# EAGLE schematic #1_routed (EAGLE 9.6.2)
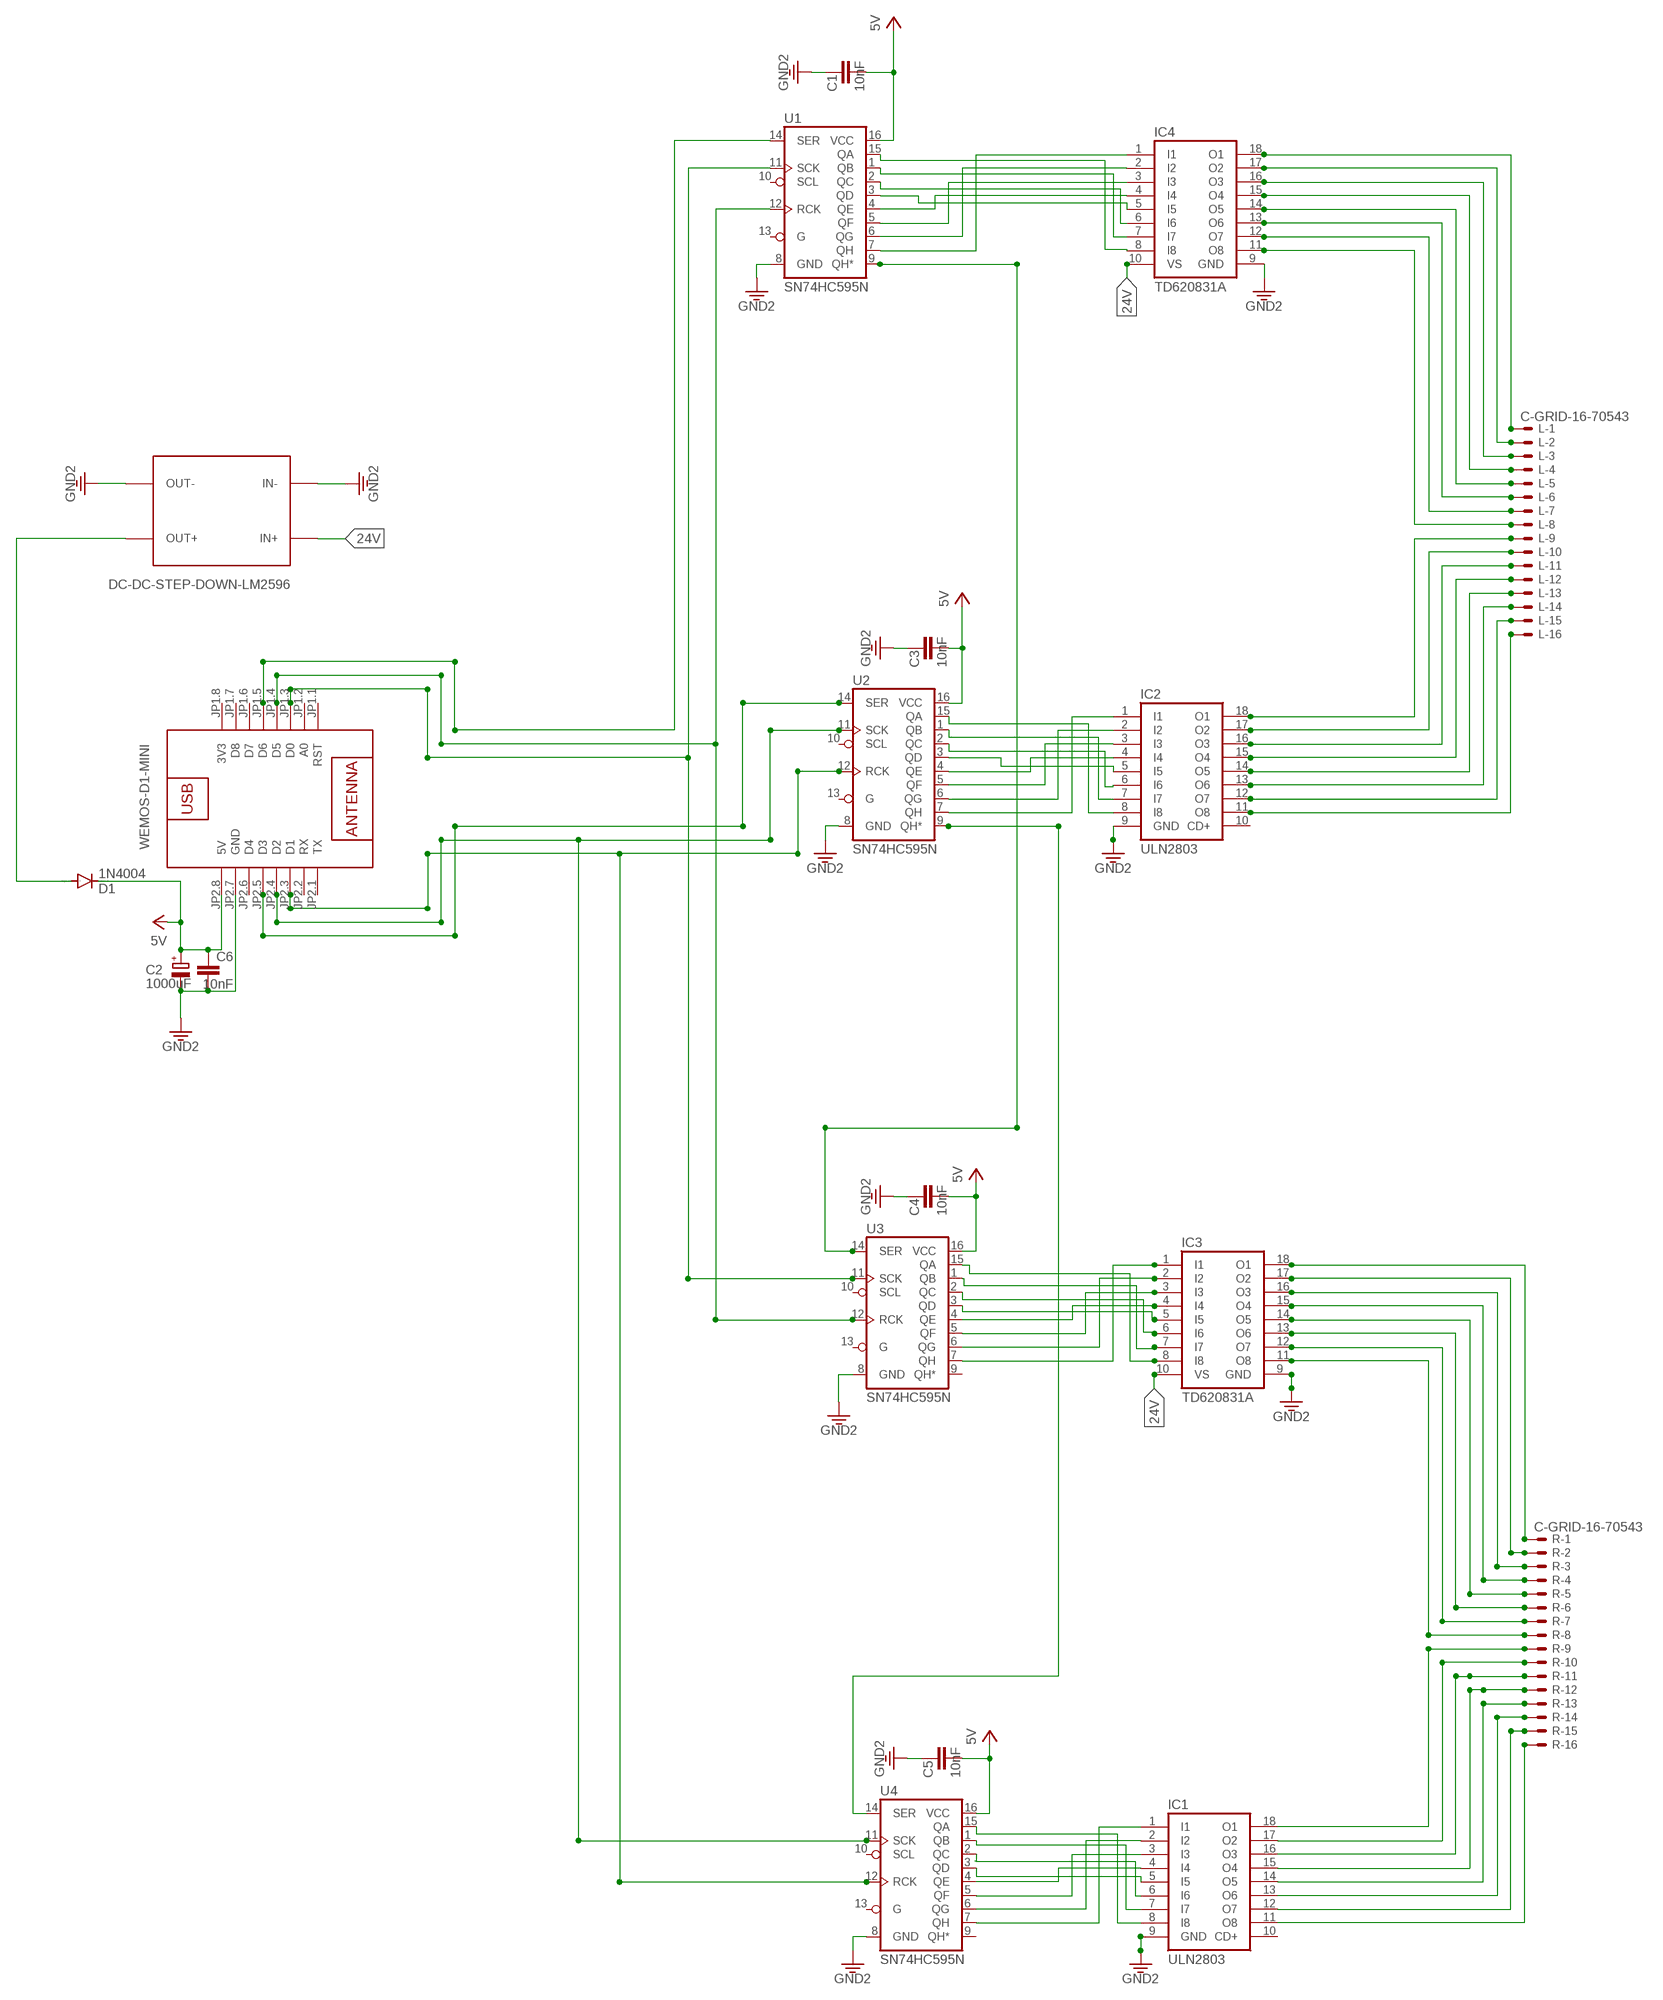
[diagram p0: schematic, sheet 1]

## Parts
C1  10nF  C-EU025-025X050  [C025-025X050]
C2  1000uF  CPOL-EUE5-10.5  [E5-10,5]
C3  10nF  C-EU025-025X050  [C025-025X050]
C4  10nF  C-EU025-025X050  [C025-025X050]
C5  10nF  C-EU025-025X050  [C025-025X050]
C6  10nF  C-EU025-025X050  [C025-025X050]
D1  1N4004  [DO41-10]
IC1  ULN2803  ULN2803A  [DIL18]
IC2  ULN2803  ULN2803A  [DIL18]
IC3  TD620831A  [DIL18]
IC4  TD620831A  [DIL18]
L  C-GRID-16-70543  [70543-16]
R  C-GRID-16-70543  [70543-16]
U1  SN74HC595N  74HC595N  [DIP16]
U2  SN74HC595N  74HC595N  [DIP16]
U3  SN74HC595N  74HC595N  [DIP16]
U4  SN74HC595N  74HC595N  [DIP16]
U$1  WEMOS-D1-MINI  [WEMOS-D1-MINI]
U$2  DC-DC-STEP-DOWN-LM2596  [DC-DC-STEP-DOWN-LM2596]

## Nets
3.3V: U$2.IN- U$2.OUT- ; supply symbol labelled GND2
24V: IC3.10(VS) IC4.10(VS) U$2.IN+
GND: C1.1 C2.- C3.1 C4.1 C5.1 C6.2 IC1.9(GND) IC2.9(GND) IC3.9(GND) IC4.9(GND) U1.8(GND) U2.8(GND) U3.8(GND) U4.8(GND) U$1.JP2.7(GND) ; supply symbol labelled GND2
N$1: IC2.1(I1) U2.7(QH)
N$2: IC2.2(I2) U2.6(QG)
N$3: IC2.3(I3) U2.5(QF)
N$4: IC2.4(I4) U2.4(QE)
N$5: IC2.5(I5) U2.3(QD)
N$6: IC2.6(I6) U2.2(QC)
N$7: IC2.7(I7) U2.1(QB)
N$8: IC2.8(I8) U2.15(QA)
N$9: IC4.18(O1) L.1
N$10: IC4.17(O2) L.2
N$11: IC4.16(O3) L.3
N$12: IC4.15(O4) L.4
N$13: IC4.14(O5) L.5
N$14: IC4.13(O6) L.6
N$15: IC4.12(O7) L.7
N$16: IC4.11(O8) L.8
N$17: IC2.11(O8) L.16
N$18: IC2.12(O7) L.15
N$19: IC2.13(O6) L.14
N$20: IC2.14(O5) L.13
N$21: IC2.15(O4) L.12
N$22: IC2.16(O3) L.11
N$23: IC2.17(O2) L.10
N$24: IC2.18(O1) L.9
N$25: IC4.1(I1) U1.7(QH)
N$26: IC3.17(O2) R.2
N$27: IC4.2(I2) U1.6(QG)
N$28: IC3.15(O4) R.4
N$29: IC4.3(I3) U1.5(QF)
N$30: IC3.13(O6) R.6
N$31: IC4.4(I4) U1.4(QE)
N$32: IC4.5(I5) U1.3(QD)
N$33: IC3.11(O8) R.8
N$34: U1.14(SER) U$1.JP1.5(D6)
N$35: IC1.1(I1) U4.7(QH)
N$36: U1.12(RCK) U3.12(RCK) U$1.JP1.4(D5)
N$37: U2.14(SER) U$1.JP2.5(D3)
N$38: U2.12(RCK) U4.12(RCK) U$1.JP2.3(D1)
N$39: IC1.11(O8) R.16
N$40: IC1.12(O7) R.15
N$41: IC4.6(I6) U1.2(QC)
N$42: IC4.7(I7) U1.1(QB)
N$43: IC4.8(I8) U1.15(QA)
N$44: IC3.2(I2) U3.6(QG)
N$45: IC3.3(I3) U3.5(QF)
N$46: IC3.4(I4) U3.4(QE)
N$47: IC3.5(I5) U3.3(QD)
N$48: IC3.6(I6) U3.2(QC)
N$49: IC1.13(O6) R.14
N$50: IC1.14(O5) R.13
N$51: IC1.15(O4) R.12
N$52: IC1.16(O3) R.11
N$53: IC1.17(O2) R.10
N$54: IC1.18(O1) R.9
N$55: IC3.7(I7) U3.1(QB)
N$56: IC3.8(I8) U3.15(QA)
N$57: IC3.18(O1) R.1
N$58: IC1.2(I2) U4.6(QG)
N$59: IC3.16(O3) R.3
N$60: IC1.3(I3) U4.5(QF)
N$61: IC3.14(O5) R.5
N$62: IC1.4(I4) U4.4(QE)
N$63: IC3.12(O7) R.7
N$64: IC1.5(I5) U4.3(QD)
N$65: IC1.6(I6) U4.2(QC)
N$66: IC1.7(I7) U4.1(QB)
N$67: IC1.8(I8) U4.15(QA)
N$69: D1.A U$2.OUT+
N$72: IC3.1(I1) U3.7(QH)
N$77: U2.9(QH*) U4.14(SER)
N$79: U1.11(SCK) U3.11(SCK) U$1.JP1.3(D0)
N$80: U2.11(SCK) U4.11(SCK) U$1.JP2.4(D2)
N$92: U1.9(QH*) U3.14(SER)
VCC: C1.2 C2.+ C3.2 C4.2 C5.2 C6.1 D1.C U1.16(VCC) U2.16(VCC) U3.16(VCC) U4.16(VCC) U$1.JP2.8(5V) ; supply symbol labelled 5V
Unconnected: IC1.10(CD+) IC2.10(CD+) U1.10(SCL) U1.13(G) U2.10(SCL) U2.13(G) U3.9(QH*) U3.10(SCL) U3.13(G) U4.9(QH*) U4.10(SCL) U4.13(G) U$1.JP1.1(RST) U$1.JP1.2(A0) U$1.JP1.6(D7) U$1.JP1.7(D8) U$1.JP2.1(TX) U$1.JP2.2(RX) U$1.JP2.6(D4)

## Power pins joined to a net without a drawn wire
3V3: U$1.JP1.8(3V3)

## Library data of the parts
C1 C3-C6 = resistor:C-EU: CAPACITOR, European symbol
C2 = resistor:CPOL-EU: POLARIZED CAPACITOR, European symbol
D1 = diode:1N4004: DIODE general purpose rectifier, 1 A
IC1 IC2 = uln-udn:ULN2803A: DRIVER ARRAY
IC3 IC4 = td62083-dil:TD62083: DRIVER ARRAY Source: Allegro Microsystems Inc. / UDN2981-UDN2984.pdf
L R = con-molex:C-GRID-16: CONNECTOR wire to board 2.54 mm (0.100") pitch header; MF: MOLEX; OC_FARNELL: unknown; OC_NEWARK: unknown
U1-U4 = SparkFun-IC-Logic:74*595: 8-Bit Shift Register (Serial to Parallel) Datasheet <http://cdn.sparkfun.com/datasheets/BreakoutBoards/MM74HC595.pdf> SparkFun Products SparkFun Shift Register Breakout - 74HC595 <https://www.sparkfun.com/products/10680> (BOB-10680); PROD_ID: IC-13123
U$1 = diy-modules:WEMOS-D1-MINI: WEMOS D1 mini: Mini Wi-Fi Board based on ESP-8266 device More details can be found here: https://www.wemos.cc/product/d1-mini.html Click here to find device on ebay.com <http://www.ebay.com/sch/wemos+d1+mini+nodemcu>
U$2 = diy-modules_lm2596:DC-DC-STEP-DOWN-LM2596: DC/DC Step-Down Regulator based on LM2596-ADJ chip LM2596 datasheet available here: http://www.ti.com/lit/ds/symlink/lm2596.pdf Click here to find device on ebay.com <http://www.ebay.com/sch/lm2596+power+regulator>